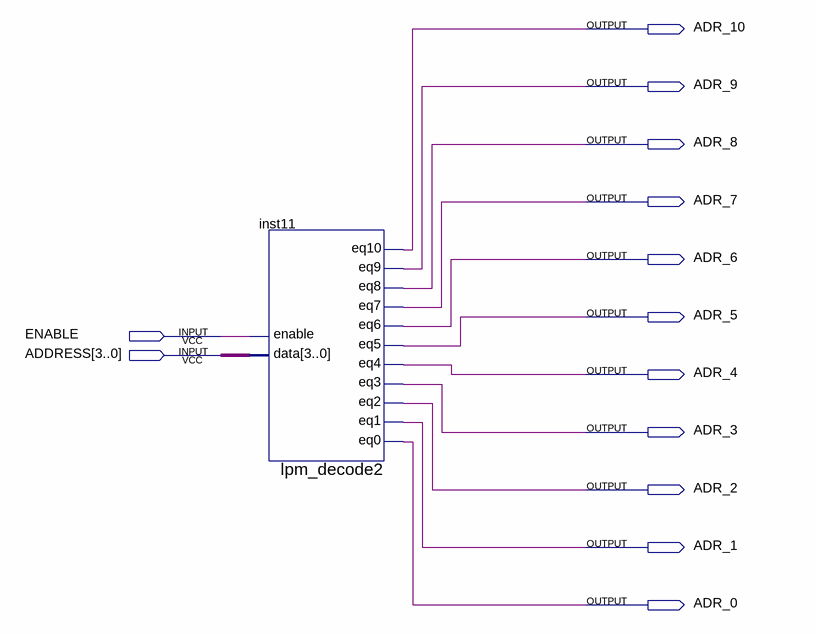
[diagram p0: schematic sheet]
// Quartus schematic STACK_MEMORY_PARCER.bdf as structural Verilog: 1 symbols, 13 pins
module STACK_MEMORY_PARCER (
  input  ENABLE,
  input  [3:0] ADDRESS,
  output ADR_10,
  output ADR_9,
  output ADR_8,
  output ADR_7,
  output ADR_6,
  output ADR_5,
  output ADR_4,
  output ADR_3,
  output ADR_2,
  output ADR_1,
  output ADR_0
);

  lpm_decode2 inst11 (
    .data(ADDRESS), .enable(ENABLE), .eq0(ADR_0), .eq1(ADR_1), .eq2(ADR_2), .eq3(ADR_3), .eq4(ADR_4),
    .eq5(ADR_5), .eq6(ADR_6), .eq7(ADR_7), .eq8(ADR_8), .eq9(ADR_9), .eq10(ADR_10));
endmodule
